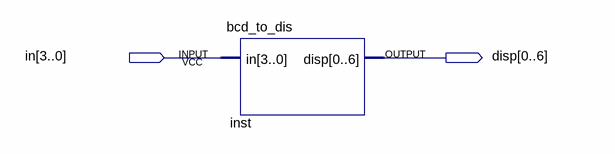
[diagram p0: schematic sheet]
// Quartus schematic 7seg.bdf as structural Verilog: 1 symbols, 2 pins
module \7seg  (
  input  [3:0] in,
  output [0:6] disp
);

  bcd_to_dis inst (.in(in), .disp(disp));
endmodule
